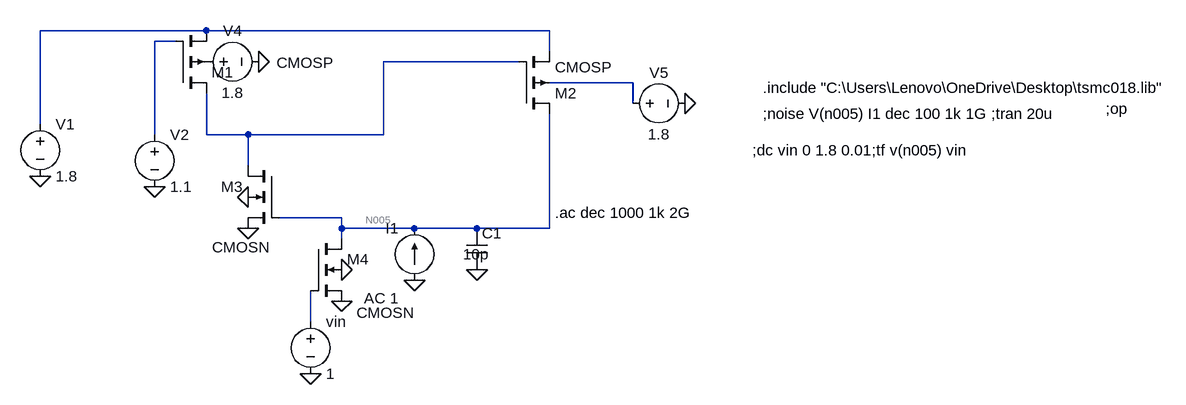
[diagram p0: schematic Active Ind.asc]
Active Ind.asc, the LTspice schematic file:
Version 4
SHEET 1 1784 680
WIRE 176 -64 -80 -64
WIRE 304 -64 176 -64
WIRE 672 -64 304 -64
WIRE 704 -64 672 -64
WIRE 128 -48 96 -48
WIRE 704 -32 704 -64
WIRE 624 -16 448 -16
WIRE 656 -16 624 -16
WIRE 832 16 704 16
WIRE 832 48 832 16
WIRE -80 80 -80 -64
WIRE 704 80 704 64
WIRE 96 96 96 -48
WIRE 176 96 176 32
WIRE 240 96 176 96
WIRE 448 96 448 -16
WIRE 448 96 240 96
WIRE 240 128 240 96
WIRE 240 144 240 128
WIRE 352 224 288 224
WIRE 384 224 352 224
WIRE 384 240 384 224
WIRE 496 240 384 240
WIRE 592 240 496 240
WIRE 704 240 704 80
WIRE 704 240 592 240
WIRE 384 256 384 240
WIRE 336 384 336 336
FLAG -80 160 0
FLAG 96 176 0
FLAG 496 320 0
FLAG 384 352 0
FLAG 336 464 0
FLAG 592 304 0
FLAG 384 304 0
FLAG 256 -16 0
FLAG 912 48 0
FLAG 240 192 0
FLAG 240 240 0
DATAFLAG 240 128 ""
DATAFLAG 304 -64 ""
DATAFLAG 672 -64 ""
DATAFLAG 704 80 ""
DATAFLAG 624 -16 ""
DATAFLAG 352 224 ""
SYMBOL voltage -80 64 R0
WINDOW 123 0 0 Left 2
WINDOW 39 0 0 Left 2
SYMATTR InstName V1
SYMATTR Value 1.8
SYMBOL voltage 96 80 R0
WINDOW 123 0 0 Left 2
WINDOW 39 0 0 Left 2
SYMATTR InstName V2
SYMATTR Value 1.1
SYMBOL voltage 336 368 R0
WINDOW 123 24 112 Left 2
WINDOW 39 0 0 Left 2
SYMATTR InstName vin
SYMATTR Value 1
SYMBOL pmos4 128 32 M180
WINDOW 3 156 47 Left 2
SYMATTR InstName M1
SYMATTR Value CMOSP
SYMATTR Value2 l=0.36u w=20u
SYMBOL pmos4 656 64 M180
SYMATTR InstName M2
SYMATTR Value CMOSP
SYMATTR Value2 l=0.36u w=20u
SYMBOL nmos4 288 144 M0
WINDOW 3 14 125 Left 2
SYMATTR InstName M3
SYMATTR Value CMOSN
SYMATTR Value2 l=0.36u w=10u
SYMBOL nmos4 336 256 R0
WINDOW 3 71 114 Left 2
SYMATTR InstName M4
SYMATTR Value CMOSN
SYMATTR Value2 l=0.36u w=10u
SYMBOL cap 576 240 R0
WINDOW 3 -5 40 Left 2
SYMATTR InstName C1
SYMATTR Value 10p
SYMBOL voltage 160 -16 R270
WINDOW 0 32 56 VTop 2
WINDOW 3 -32 56 VBottom 2
SYMATTR InstName V4
SYMATTR Value 1.8
SYMBOL voltage 816 48 R270
WINDOW 0 32 56 VTop 2
WINDOW 3 -32 56 VBottom 2
SYMATTR InstName V5
SYMATTR Value 1.8
SYMBOL current 496 320 R180
WINDOW 0 24 80 Left 2
WINDOW 3 24 0 Left 2
WINDOW 123 24 -28 Left 2
WINDOW 39 0 0 Left 2
SYMATTR InstName I1
SYMATTR Value ""
SYMATTR Value2 AC 1
TEXT 1032 24 Left 2 !.include "C:\\Users\\Lenovo\\OneDrive\\Desktop\\tsmc018.lib"
TEXT 1384 64 Left 2 !;tran 20u
TEXT 1032 64 Left 2 !;noise V(n005) I1 dec 100 1k 1G
TEXT 1560 56 Left 2 !;op
TEXT 1016 120 Left 2 !;dc vin 0 1.8 0.01
TEXT 712 216 Left 2 !.ac dec 1000 1k 2G
TEXT 1200 120 Left 2 !;tf v(n005) vin

The netlist it stands for:
* Active Ind.asc
V1 N001 0 1.8
V2 N002 0 1.1
vin N006 0 1
M1 N003 N002 N001 P001 CMOSP l=0.36u w=20u
M2 N005 N003 N001 N004 CMOSP l=0.36u w=20u
M3 N003 N005 0 0 CMOSN l=0.36u w=10u
M4 N005 N006 0 0 CMOSN l=0.36u w=10u
C1 N005 0 10p
V4 P001 0 1.8
V5 N004 0 1.8
I1 0 N005 AC 1
.model NMOS NMOS
.model PMOS PMOS
.lib standard.mos
.include "C:\Users\Lenovo\OneDrive\Desktop\tsmc018.lib"
;tran 20u
;noise V(n005) I1 dec 100 1k 1G
;op
;dc vin 0 1.8 0.01
.ac dec 1000 1k 2G
;tf v(n005) vin
.backanno
.end